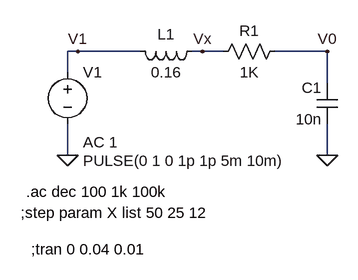
[diagram p0: schematic Resonancia serie.LTspice.asc]
Resonancia serie.LTspice.asc, the LTspice schematic file:
Version 4
SHEET 1 880 680
WIRE -128 80 -144 80
WIRE -32 80 -128 80
WIRE 64 80 48 80
WIRE 96 80 64 80
WIRE 256 80 176 80
WIRE -144 112 -144 80
WIRE 256 128 256 80
WIRE -144 240 -144 192
WIRE 256 240 256 192
FLAG 256 240 0
FLAG -144 240 0
FLAG 256 80 V0
FLAG -128 80 V1
FLAG 64 80 Vx
SYMBOL res 80 96 R270
WINDOW 0 32 56 VTop 2
WINDOW 3 0 56 VBottom 2
SYMATTR InstName R1
SYMATTR Value 1K
SYMBOL cap 272 192 R180
WINDOW 0 24 56 Left 2
WINDOW 3 24 8 Left 2
SYMATTR InstName C1
SYMATTR Value 10n
SYMBOL ind 64 64 R90
WINDOW 0 5 56 VBottom 2
WINDOW 3 32 56 VTop 2
SYMATTR InstName L1
SYMATTR Value 0.16
SYMBOL voltage -144 96 R0
WINDOW 3 24 152 Left 2
WINDOW 123 24 124 Left 2
WINDOW 39 0 0 Left 0
SYMATTR Value PULSE(0 1 0 1p 1p 5m 10m)
SYMATTR Value2 AC 1
SYMATTR InstName V1
TEXT -208 296 Left 2 !.ac dec 100 1k 100k
TEXT -216 328 Left 2 !;step param X list 50 25 12
TEXT -200 384 Left 2 !;tran 0 0.04 0.01

The netlist it stands for:
* Resonancia serie.LTspice.asc
R1 Vx V0 1K
C1 0 V0 10n
L1 Vx V1 0.16
V1 V1 0 PULSE(0 1 0 1p 1p 5m 10m) AC 1
.ac dec 100 1k 100k
;step param X list 50 25 12
;tran 0 0.04 0.01
.backanno
.end